# EAGLE schematic main (EAGLE 6.5.0)
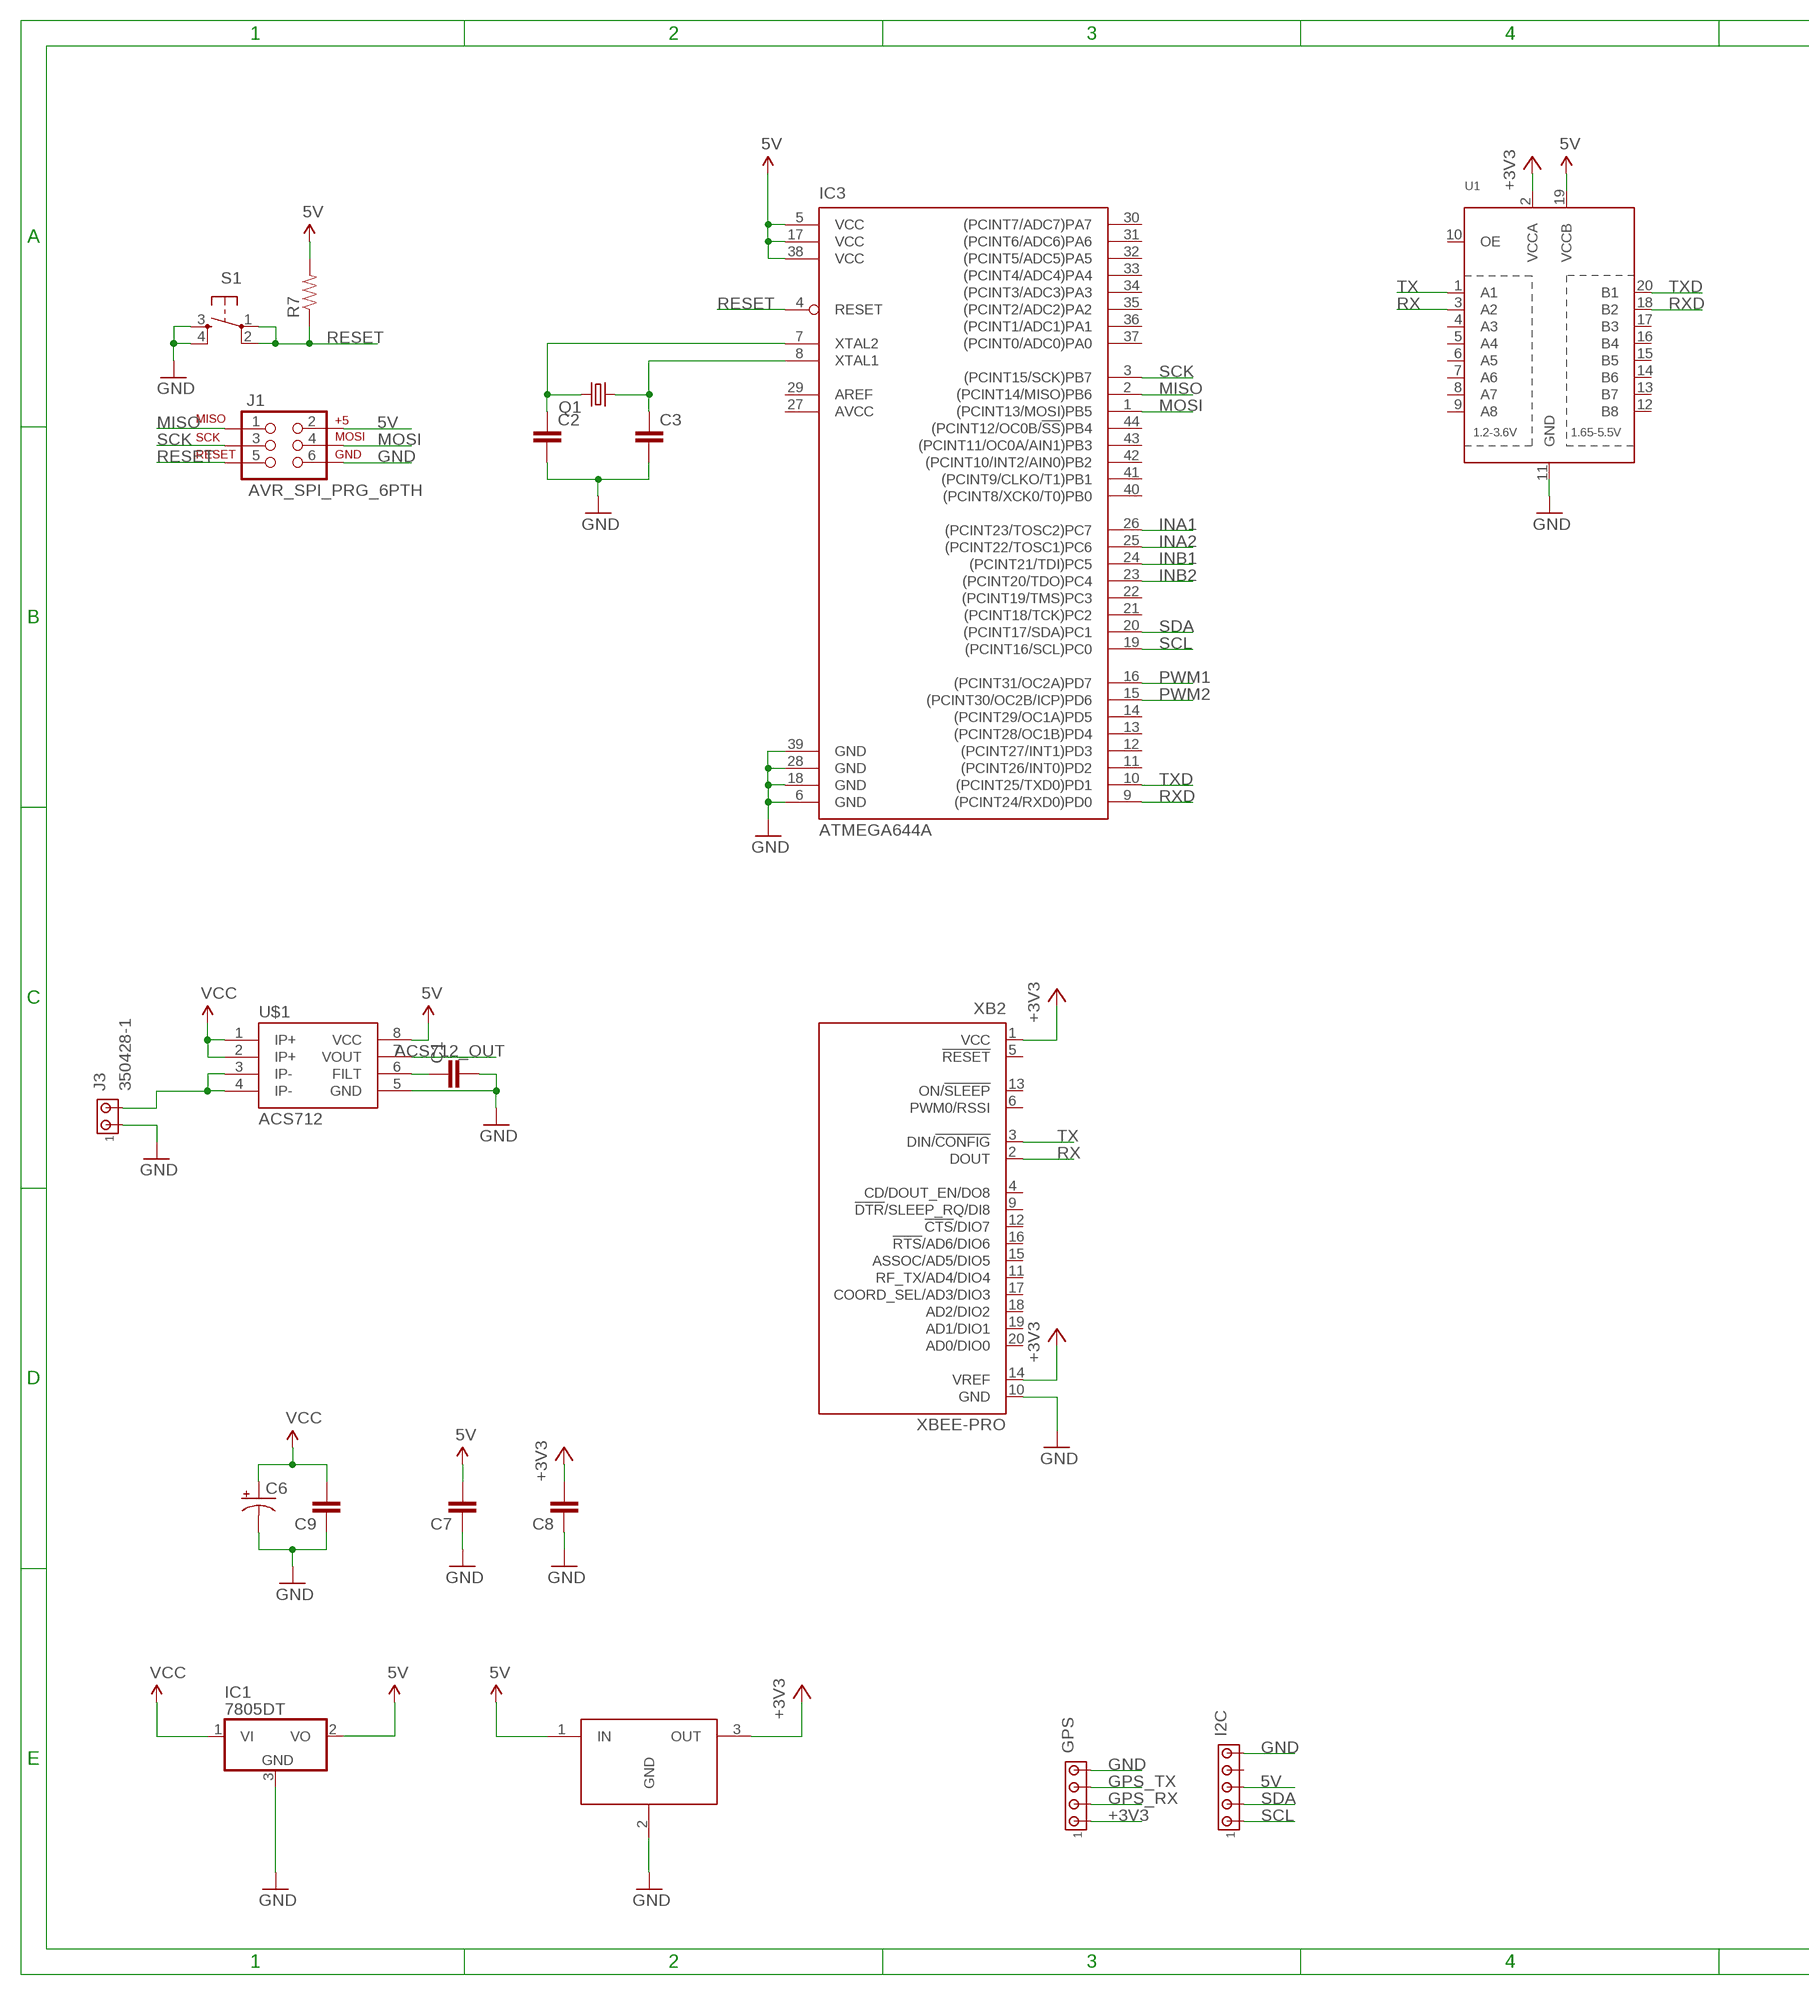
[diagram p0: schematic, sheet 1, part 1 of 2]
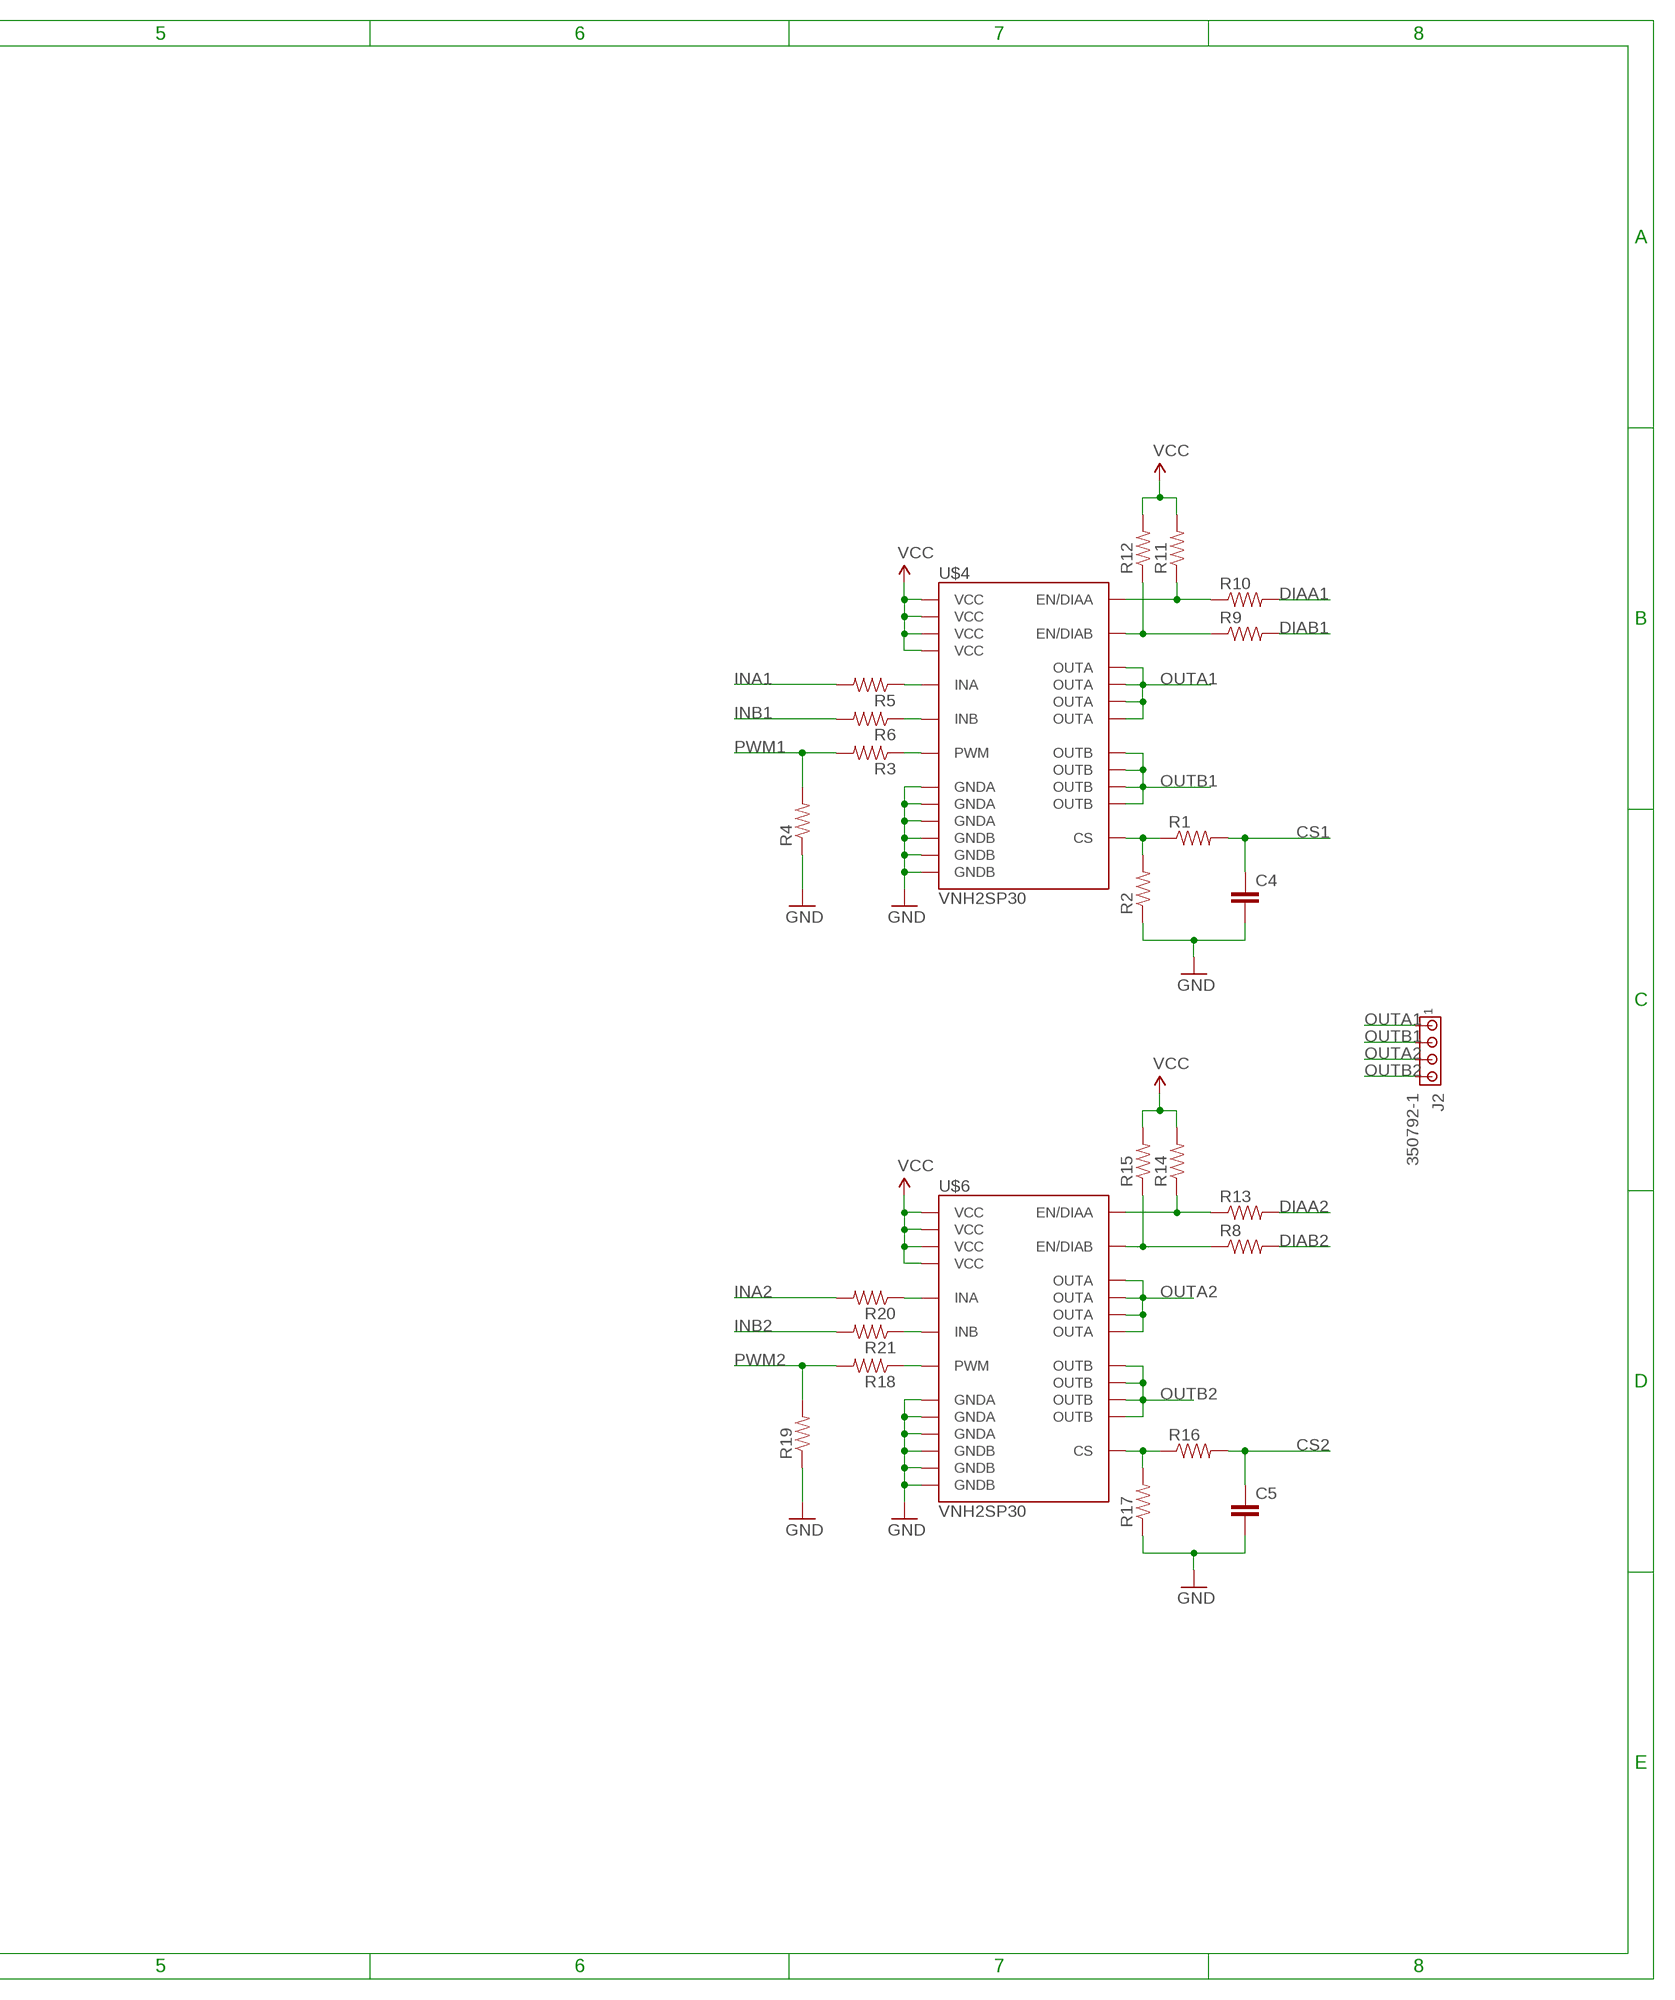
[diagram p1: schematic, sheet 1, part 2 of 2]

## Parts
C1  CAP0603-CAP  [0603-CAP]
C2  CAP0603-CAP  [0603-CAP]
C3  CAP0603-CAP  [0603-CAP]
C4  CAP0603-CAP  [0603-CAP]
C5  CAP0603-CAP  [0603-CAP]
C6  CPOL-US140CLH-1010  [140CLH-1010]
C7  CAP0603-CAP  [0603-CAP]
C8  CAP0603-CAP  [0603-CAP]
C9  CAP0603-CAP  [0603-CAP]
GPS  MTA04-100  [10X04MTA]
I2C  MTA05-100  [10X05MTA]
IC1  7805DT  [TO252]
IC3  ATMEGA644A  [TQFP44]
J1  AVR_SPI_PRG_6PTH  [2X3]
J2  350792-1  [350792-1]
J3  350428-1  [350428-1]
LM3940(SOT223)  LM3940 SOT223  LM3940IMP-3.3  [SOT223]
Q1  CRYSTALHC49UP  [HC49UP]
R1  RESISTOR0603-RES  [0603-RES]
R2  RESISTOR0603-RES  [0603-RES]
R3  RESISTOR0603-RES  [0603-RES]
R4  RESISTOR0603-RES  [0603-RES]
R5  RESISTOR0603-RES  [0603-RES]
R6  RESISTOR0603-RES  [0603-RES]
R7  RESISTOR0603-RES  [0603-RES]
R8  RESISTOR0603-RES  [0603-RES]
R9  RESISTOR0603-RES  [0603-RES]
R10  RESISTOR0603-RES  [0603-RES]
R11  RESISTOR0603-RES  [0603-RES]
R12  RESISTOR0603-RES  [0603-RES]
R13  RESISTOR0603-RES  [0603-RES]
R14  RESISTOR0603-RES  [0603-RES]
R15  RESISTOR0603-RES  [0603-RES]
R16  RESISTOR0603-RES  [0603-RES]
R17  RESISTOR0603-RES  [0603-RES]
R18  RESISTOR0603-RES  [0603-RES]
R19  RESISTOR0603-RES  [0603-RES]
R20  RESISTOR0603-RES  [0603-RES]
R21  RESISTOR0603-RES  [0603-RES]
S1  TAC_SWITCHSMD  [TACTILE_SWITCH_SMD]
U1  TXB0108PWR  [TSSOP20]
U$1  ACS712  [SO08]
U$4  VNH2SP30  [VNH2SP30]
U$6  VNH2SP30  [VNH2SP30]
XB2  XBEE-PRO  [XBEE-PRO]

## Nets
5V [VCC]: C7.2 I2C.3 IC1.2(VO) IC3.5(VCC) IC3.17(VCC) IC3.38(VCC) J1.2 LM3940(SOT223).1(IN) R7.2 U1.19(VCCB) U$1.8(VCC)
+3V3: C8.2 GPS.1 LM3940(SOT223).3(OUT) U1.2(VCCA) XB2.1(VCC) XB2.14(VREF)
ACS712_OUT: U$1.7(VOUT)
CS1: C4.1 R1.2
CS2: C5.1 R16.2
DIAA1: R10.2
DIAA2: R13.2
DIAB1: R9.2
DIAB2: R8.2
GND [Ground]: C1.2 C2.2 C3.2 C4.2 C5.2 C6.- C7.1 C8.1 C9.1 GPS.4 I2C.5 IC1.3(GND) IC3.6(GND) IC3.18(GND) IC3.28(GND) IC3.39(GND) J1.6 J3.1 LM3940(SOT223).2(GND) R2.1 R4.1 R17.1 R19.1 S1.3 S1.4 U1.11(GND) U$1.5(GND) U$4.18(GNDB) U$4.19(GNDB) U$4.20(GNDB) U$4.26(GNDA) U$4.27(GNDA) U$4.28(GNDA) U$6.18(GNDB) U$6.19(GNDB) U$6.20(GNDB) U$6.26(GNDA) U$6.27(GNDA) U$6.28(GNDA) XB2.10(GND)
GPS_RX: GPS.2
GPS_TX: GPS.3
INA1: IC3.26((PCINT23/TOSC2)PC7) R5.2
INA2: IC3.25((PCINT22/TOSC1)PC6) R20.2
INB1: IC3.24((PCINT21/TDI)PC5) R6.2
INB2: IC3.23((PCINT20/TDO)PC4) R21.2
MISO: IC3.2((PCINT14/MISO)PB6) J1.1
MOSI: IC3.1((PCINT13/MOSI)PB5) J1.4
N$1: C1.1 U$1.6(FILT)
N$2: C2.1 IC3.7(XTAL2) Q1.2
N$3: C3.1 IC3.8(XTAL1) Q1.1
N$6: R1.1 R2.2 U$4.9(CS)
N$7: R3.1 U$4.8(PWM)
N$8: R5.1 U$4.5(INA)
N$9 [VCC]: J3.2 U$1.3(IP-) U$1.4(IP-)
N$10: R6.1 U$4.11(INB)
N$11: R8.1 R15.1 U$6.10(EN/DIAB)
N$12: R13.1 R14.1 U$6.6(EN/DIAA)
N$15: R9.1 R12.1 U$4.10(EN/DIAB)
N$16: R10.1 R11.1 U$4.6(EN/DIAA)
N$17: R16.1 R17.2 U$6.9(CS)
N$18: R18.1 U$6.8(PWM)
N$19: R20.1 U$6.5(INA)
N$20: R21.1 U$6.11(INB)
OUTA1: J2.1 U$4.1(OUTA) U$4.25(OUTA) U$4.30(OUTA) U$4.SLUG3(OUTA)
OUTA2: J2.3 U$6.1(OUTA) U$6.25(OUTA) U$6.30(OUTA) U$6.SLUG3(OUTA)
OUTB1: J2.2 U$4.15(OUTB) U$4.16(OUTB) U$4.21(OUTB) U$4.SLUG2(OUTB)
OUTB2: J2.4 U$6.15(OUTB) U$6.16(OUTB) U$6.21(OUTB) U$6.SLUG2(OUTB)
PWM1: IC3.16((PCINT31/OC2A)PD7) R3.2 R4.2
PWM2: IC3.15((PCINT30/OC2B/ICP)PD6) R18.2 R19.2
RESET: IC3.4(RESET) J1.5 R7.1 S1.1 S1.2
RX: U1.3(A2) XB2.2(DOUT)
RXD: IC3.9((PCINT24/RXD0)PD0) U1.18(B2)
SCK: IC3.3((PCINT15/SCK)PB7) J1.3
SCL: I2C.1 IC3.19((PCINT16/SCL)PC0)
SDA: I2C.2 IC3.20((PCINT17/SDA)PC1)
TX: U1.1(A1) XB2.3(DIN/!CONFIG)
TXD: IC3.10((PCINT25/TXD0)PD1) U1.20(B1)
VCC: C6.+ C9.2 IC1.1(VI) R11.2 R12.2 R14.2 R15.2 U$1.1(IP+) U$1.2(IP+) U$4.3(VCC) U$4.13(VCC) U$4.23(VCC) U$4.SLUG1(VCC) U$6.3(VCC) U$6.13(VCC) U$6.23(VCC) U$6.SLUG1(VCC)
Unconnected: I2C.4 IC3.11((PCINT26/INT0)PD2) IC3.12((PCINT27/INT1)PD3) IC3.13((PCINT28/OC1B)PD4) IC3.14((PCINT29/OC1A)PD5) IC3.21((PCINT18/TCK)PC2) IC3.22((PCINT19/TMS)PC3) IC3.29(AREF) IC3.30((PCINT7/ADC7)PA7) IC3.31((PCINT6/ADC6)PA6) IC3.32((PCINT5/ADC5)PA5) IC3.33((PCINT4/ADC4)PA4) IC3.34((PCINT3/ADC3)PA3) IC3.35((PCINT2/ADC2)PA2) IC3.36((PCINT1/ADC1)PA1) IC3.37((PCINT0/ADC0)PA0) IC3.40((PCINT8/XCK0/T0)PB0) IC3.41((PCINT9/CLKO/T1)PB1) IC3.42((PCINT10/INT2/AIN0)PB2) IC3.43((PCINT11/OC0A/AIN1)PB3) IC3.44((PCINT12/OC0B/!SS!)PB4) U1.4(A3) U1.5(A4) U1.6(A5) U1.7(A6) U1.8(A7) U1.9(A8) U1.10(OE) U1.12(B8) U1.13(B7) U1.14(B6) U1.15(B5) U1.16(B4) U1.17(B3) XB2.4(CD/DOUT_EN/DO8) XB2.5(!RESET) XB2.6(PWM0/RSSI) XB2.9(!DTR!/SLEEP_RQ/DI8) XB2.11(RF_TX/AD4/DIO4) XB2.12(!CTS!/DIO7) XB2.13(ON/!SLEEP) XB2.15(ASSOC/AD5/DIO5) XB2.16(!RTS!/AD6/DIO6) XB2.17(COORD_SEL/AD3/DIO3) XB2.18(AD2/DIO2) XB2.19(AD1/DIO1) XB2.20(AD0/DIO0)

## Power pins joined to a net without a drawn wire
AVCC: IC3.27(AVCC)

## Library data of the parts
C1-C5 C7-C9 = SparkFun:CAP: Capacitor Standard 0603 ceramic capacitor, and 0.1" leaded capacitor.
C6 = adafruit:CPOL-US: POLARIZED CAPACITOR, American symbol
GPS = con-amp:MTA04-100: AMP connector
I2C = con-amp:MTA05-100: AMP connector
IC1 = linear:78*: Positive VOLTAGE REGULATOR Source: http://cache.national.com/ds/LM/LM78L05.pdf http://www.fairchildsemi.com/ds/LM/LM7805.pdf
IC3 = atmel:ATMEGA644: 8-bit Microcontroller with 64K Bytes In-System Programmable Flash Source: http://www.atmel.com/dyn/resources/prod_documents/doc2593.pdf; MPN: ATMEGA644PV-10AU; OC_FARNELL: 1455123; OC_NEWARK: 58M3748
J1 = SparkFun:AVR_SPI_PRG_6: AVR ISP 6 Pin This is the reduced ISP connector for AVR programming. Common on Arduino. This footprint will take up less PCB space and can be used with a 10-pin to 6-pin adapter such as SKU: BOB-08508
J2 = con-amp:350792-1: Universal MATE-N-LOK .250" Centerline, 600 V, 19 - 36 A max Source: http://catalog.tycoelectronics.com/ .. ENG_CD_350792_R.pdf
J3 = con-amp:350428-1: Universal MATE-N-LOK .250" Centerline, 600 V, 19 - 36 A max Source: http://catalog.tycoelectronics.com/ .. ENG_CD_350428_Y.pdf
LM3940(SOT223) = LM3940:LM3940IMP-3.3: 1A Low Dropout Regulator for 5V to 3.3V Conversion
Q1 = crystal:CRYSTAL: CRYSTAL; OC_FARNELL: unknown; OC_NEWARK: unknown
R1-R21 = SparkFun:RESISTOR: Resistor Basic schematic elements and footprints for 0603, 1206, and PTH resistors.
S1 = SparkFun:TAC_SWITCH: Momentary Switch Button commonly used for reset or general input. Spark Fun Electronics SKU : COM-00097
U1 = adafruit:TXB0108PWR: 8-Bit Bi-Directional Level Shifter 1.2V-3.6V (VCCA) to 1.65V-5.5V (VCCB) bi-directional level shifter with auto direction sensing. Max data rate - VCCA 1.8V: 20Mbps (50ns), VCCA 3.3V: 100Mbps (10ns) Digikey: 296-21527-1-ND
U$1 = SparkFun:ACS712
U$4 U$6 = SparkFun:VNH2SP30
XB2 = maxstream:XBEE: XBee (TM) /XBee-PRO(TM) OEM RF Modules Source: MaxStream, Inc. xbee_productmanual.pdf; MPN: XBP24-AWI-001; OC_FARNELL: 1337916; OC_NEWARK: 42M2667

## Net classes
1 Ground: width 0.61 mm, clearance 0.305 mm
2 VCC: width 0.61 mm, clearance 0.305 mm